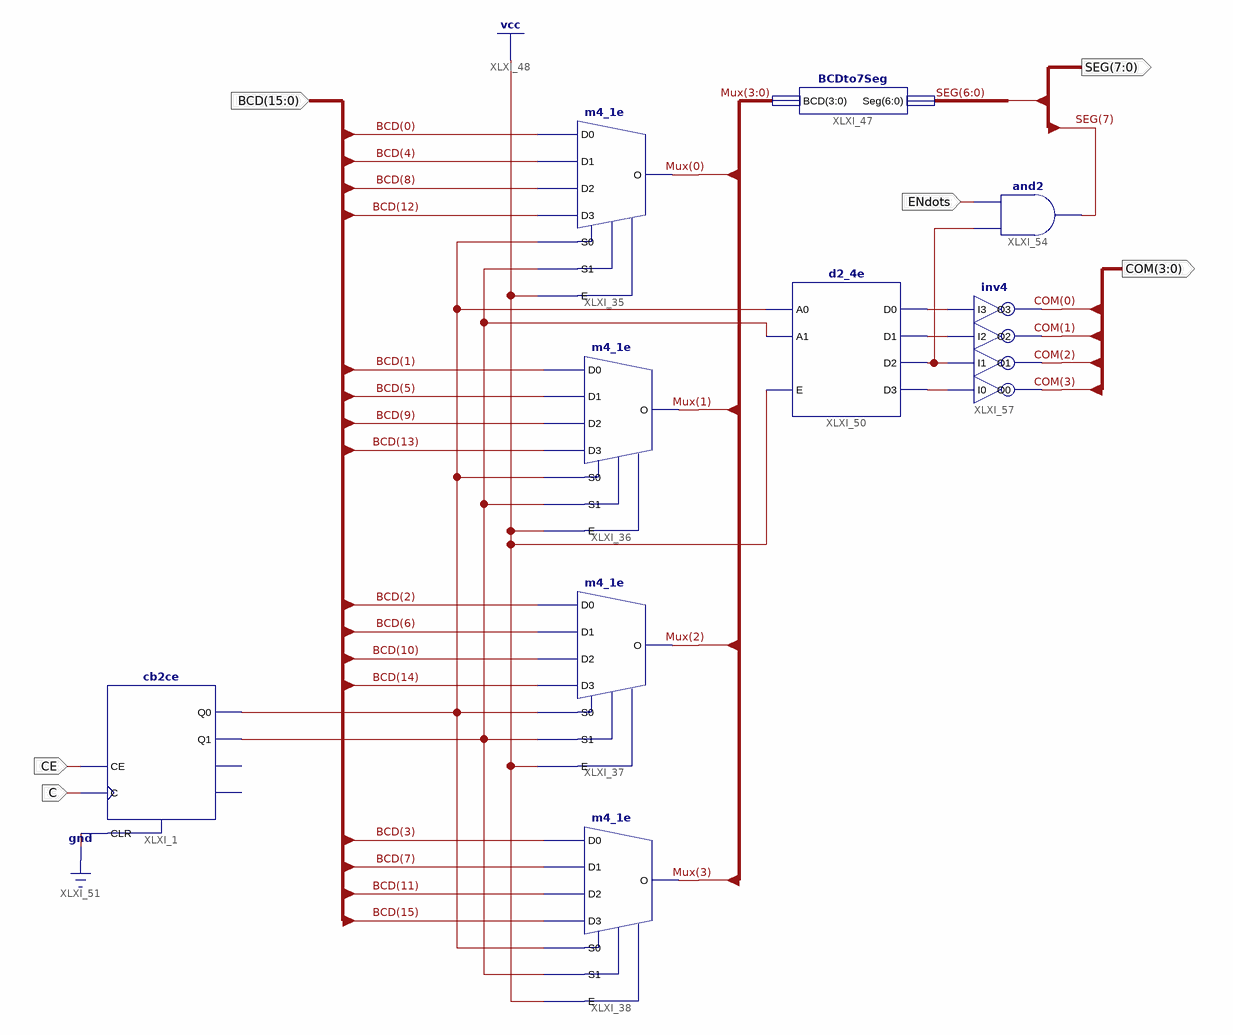
[diagram p0: schematic sheet 1]
// Xilinx ISE schematic BCDto7Seg4Digit.sch (spartan6) as structural Verilog: 9 symbols, 6 ports
module BCDto7Seg4Digit (
  input  [15:0] BCD,
  input  C,
  input  CE,
  input  ENdots,
  output [3:0] COM,
  output [7:0] SEG
);

  wire XLXN_68, XLXN_74, XLXN_184, XLXN_186, XLXN_188, XLXN_191;
  wire [3:0] Mux;

  m4_1e XLXI_36 (.D0(BCD[1]), .D1(BCD[5]), .D2(BCD[9]), .D3(BCD[13]), .E(1'b1), .S0(XLXN_74), .S1(XLXN_68), .O(Mux[1]));
  m4_1e XLXI_35 (.D0(BCD[0]), .D1(BCD[4]), .D2(BCD[8]), .D3(BCD[12]), .E(1'b1), .S0(XLXN_74), .S1(XLXN_68), .O(Mux[0]));
  m4_1e XLXI_37 (
    .D0(BCD[2]), .D1(BCD[6]), .D2(BCD[10]), .D3(BCD[14]), .E(1'b1), .S0(XLXN_74), .S1(XLXN_68), .O(Mux[2]));
  m4_1e XLXI_38 (
    .D0(BCD[3]), .D1(BCD[7]), .D2(BCD[11]), .D3(BCD[15]), .E(1'b1), .S0(XLXN_74), .S1(XLXN_68), .O(Mux[3]));
  BCDto7Seg XLXI_47 (.BCD(Mux), .Seg(SEG[6:0]));
  d2_4e XLXI_50 (.A0(XLXN_74), .A1(XLXN_68), .E(1'b1), .D0(XLXN_184), .D1(XLXN_191), .D2(XLXN_188), .D3(XLXN_186));
  cb2ce XLXI_1 (.C(C), .CE(CE), .CLR(1'b0), .Q0(XLXN_74), .Q1(XLXN_68));  // open: CEO, TC
  and XLXI_54 (SEG[7], XLXN_188, ENdots);
  inv4 XLXI_57 (
    .I0(XLXN_186), .I1(XLXN_188), .I2(XLXN_191), .I3(XLXN_184), .O0(COM[3]), .O1(COM[2]), .O2(COM[1]),
    .O3(COM[0]));
endmodule
